# EAGLE design devil (EAGLE 9.5.2)
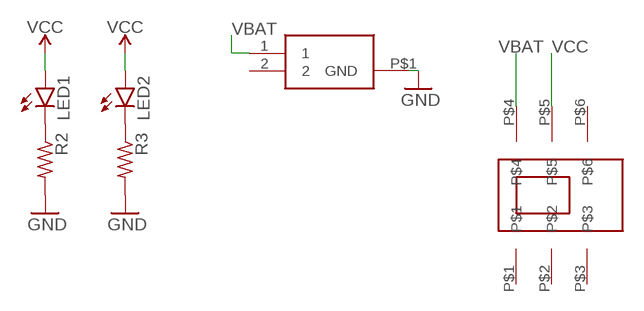
[diagram p0: schematic, sheet 1]

## Parts
LED1  LEDCHIP-LED0603  [CHIP-LED0603]
LED2  LEDCHIP-LED0603  [CHIP-LED0603]
R2  R-US_R0603  [R0603]
R3  R-US_R0603  [R0603]
U$1  CL-SB-22A-02T-SLIDE-SWITCH-TUCKED-PADS  [CL-SB-22A-02T-DPDT-COMPACT-SWITCH]
VBAT  BAT-HLD-012-SMT  [BATHLD012SMT]

## Nets
GND: R2.2 R3.2 VBAT.P$1(GND)
N$1: LED1.C R2.1
N$3: LED2.C R3.1
VBAT: U$1.P$4 VBAT.1
VCC: LED1.A LED2.A U$1.P$5
Unconnected: U$1.P$1 U$1.P$2 U$1.P$3 U$1.P$6 VBAT.2

## Library data of the parts
LED1 LED2 = led:LED: LED OSRAM: - CHIPLED LG R971, LG N971, LY N971, LG Q971, LY Q971, LO R971, LY R971 LH N974, LH R974 LS Q976, LO Q976, LY Q976 LO Q996 - Hyper CHIPLED LW Q18S LB Q993, LB Q99A, LB R99A - SideLED LS A670, LO A670, LY A670, LG A670, LP A670 LB A673, LV A673, LT A673, LW A673 LH A674 LY A675 LS A676, LA A676, LO A676, LY A676, LW A676 LS A679, LY A679, LG A679 - Hyper Micro SIDELED® LS Y876, LA Y876, LO Y876, LY Y876 LT Y87S - SmartLED LW L88C, LW L88S LB L89C, LB L89S, LG L890 LS L89K, LO L89K, LY L89K LS L896, LA L896, LO L896, LY L896 - TOPLED LS T670, LO T670, LY T670, LG T670, LP T670 LSG T670, LSP T670, LSY T670, LOP T670, LYG T670 LG T671, LOG T671, LSG T671 LB T673, LV T673, LT T673, LW T673 LH T674 LS T676, LA T676, LO T676, LY T676, LB T676, LH T676, LSB T676, LW T676 LB T67C, LV T67C, LT T67C, LS T67K, LO T67K, LY T67K, LW E67C LS E67B, LA E67B, LO E67B, LY E67B, LB E67C, LV E67C, LT E67C LW T67C LS T679, LY T679, LG T679 LS T770, LO T770, LY T770, LG T770, LP T770 LB T773, LV T773, LT T773, LW T773 LH T774 LS E675, LA E675, LY E675, LS T675 LS T776, LA T776, LO T776, LY T776, LB T776 LHGB T686 LT T68C, LB T68C - Hyper Mini TOPLED® LB M676 - Mini TOPLED Santana® LG M470 LS M47K, LO M47K, LY M47K Source: http://www.osram.convergy.de LUXEON: - LUMILED® LXK2-PW12-R00, LXK2-PW12-S00, LXK2-PW14-U00, LXK2-PW14-V00 LXK2-PM12-R00, LXK2-PM12-S00, LXK2-PM14-U00 LXK2-PE12-Q00, LXK2-PE12-R00, LXK2-PE12-S00, LXK2-PE14-T00, LXK2-PE14-U00 LXK2-PB12-K00, LXK2-PB12-L00, LXK2-PB12-M00, LXK2-PB14-N00, LXK2-PB14-P00, LXK2-PB14-Q00 LXK2-PR12-L00, LXK2-PR12-M00, LXK2-PR14-Q00, LXK2-PR14-R00 LXK2-PD12-Q00, LXK2-PD12-R00, LXK2-PD12-S00 LXK2-PH12-R00, LXK2-PH12-S00 LXK2-PL12-P00, LXK2-PL12-Q00, LXK2-PL12-R00 Source: www.luxeon.com KINGBRIGHT: KA-3528ASYC Source: www.kingbright.com
R2 R3 = rcl:R-US_: RESISTOR, American symbol; SPICEPREFIX: R
U$1 = electroninks:CL-SB-22A-02T-SLIDE-SWITCH-TUCKED-PADS
VBAT = SamacSys_Parts:BAT-HLD-012-SMT: Coin Cell Battery Holders Bat Hld CR1216/1225 Surface Mount Source: Datasheet <https://componentsearchengine.com/Datasheets/1/BAT-HLD-012-SMT.pdf>; DESCRIPTION: Coin Cell Battery Holders Bat Hld CR1216/1225 Surface Mount; HEIGHT: 3mm; MANUFACTURER_NAME: Linx Technologies; MANUFACTURER_PART_NUMBER: BAT-HLD-012-SMT; MOUSER_PART_NUMBER: 712-BAT-HLD-012-SMT; MOUSER_PRICE-STOCK: https://www.mouser.com/Search/Refine.aspx?Keyword=712-BAT-HLD-012-SMT

## Board
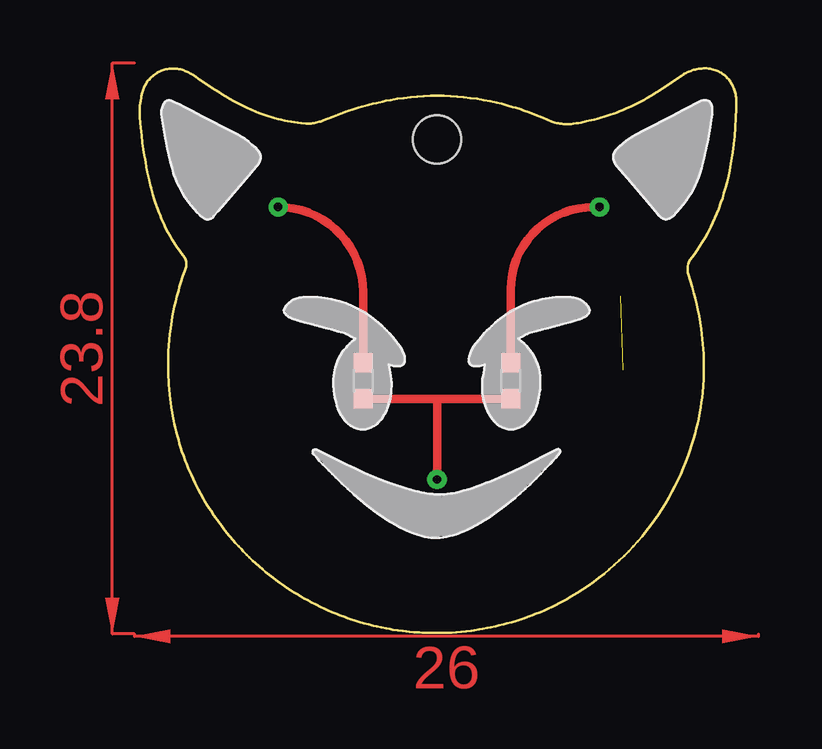
[diagram p1: board, top side]
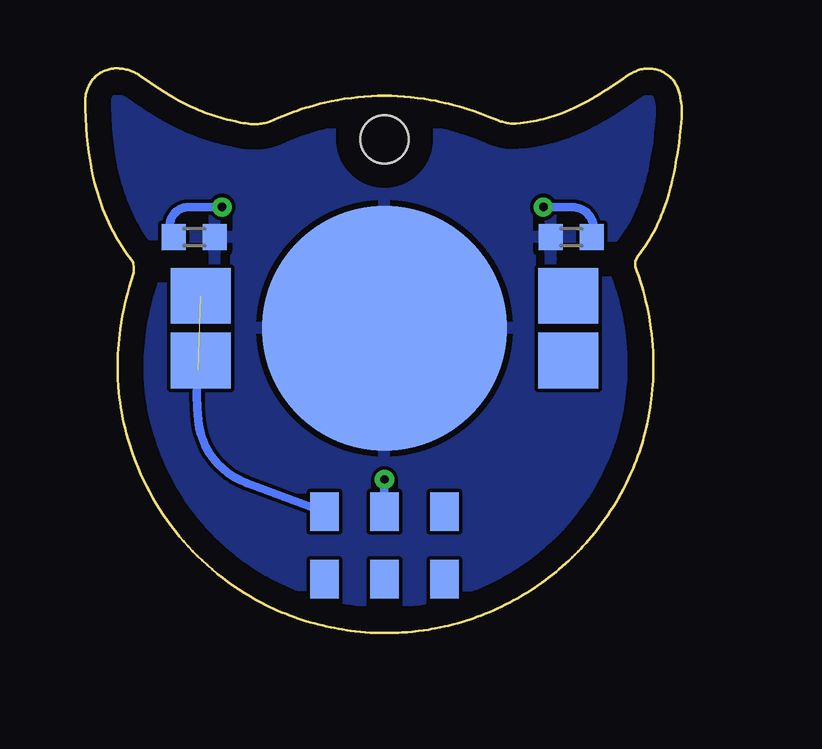
[diagram p2: board, bottom side, seen from below]

Size 24.86 x 23.54 mm. Coordinates in mm from the lower left corner, seen from the top.
Outline: 1.18,11.2 1.18,11.48 1.19,11.76 1.21,11.97 1.23,12.24 1.25,12.45 1.29,12.73 1.33,13 1.36,13.21 1.4,13.41 1.44,13.62 1.49,13.82 1.54,14.02 1.62,14.29 1.65,14.42 1.72,14.62 1.8,14.89 1.87,15.08 1.9,15.15 1.92,15.21 1.93,15.28 1.94,15.35 1.94,15.42 1.93,15.49 1.91,15.56 1.89,15.62 1.85,15.68 1.81,15.74 1.73,15.85 1.64,15.96 1.56,16.07 1.49,16.19 1.41,16.3 1.34,16.42 1.27,16.54 1.17,16.73 1.07,16.91 1.01,17.04 0.95,17.16 0.9,17.29 0.85,17.42 0.79,17.55 0.75,17.68 0.65,17.94 0.61,18.07 0.55,18.27 0.48,18.54 0.44,18.68 0.39,18.88 0.32,19.22 0.28,19.42 0.24,19.63 0.17,20.04 0.11,20.45 0.08,20.73 0.04,21.07 0.02,21.28 0.01,21.49 0,21.7 0,21.84 0,21.91 0.01,21.98 0.02,22.11 0.03,22.18 0.06,22.32 0.07,22.39 0.1,22.52 0.12,22.59 0.14,22.66 0.17,22.72 0.2,22.78 0.23,22.85 0.26,22.91 0.3,22.97 0.34,23.02 0.39,23.08 0.43,23.13 0.48,23.18 0.53,23.22 0.59,23.27 0.64,23.31 0.7,23.35 0.76,23.38 0.82,23.41 0.89,23.44 0.95,23.47 1.02,23.49 1.08,23.51 1.15,23.52 1.22,23.53 1.29,23.54 1.36,23.54 1.43,23.54 1.5,23.53 1.57,23.53 1.64,23.51 1.7,23.5 1.77,23.48 1.84,23.46 1.9,23.44 1.97,23.41 2.03,23.38 2.09,23.35 2.21,23.27 2.33,23.2 2.44,23.12 2.96,22.77 3.13,22.65 3.31,22.54 3.43,22.47 3.6,22.36 3.72,22.29 3.96,22.15 4.21,22.02 4.33,21.96 4.46,21.9 4.65,21.81 4.84,21.73 4.97,21.68 5.1,21.63 5.23,21.59 5.36,21.54 5.5,21.5 5.63,21.46 5.76,21.43 5.9,21.4 6.03,21.37 6.17,21.34 6.31,21.32 6.44,21.29 6.58,21.28 6.72,21.26 6.93,21.24 7,21.24 7.07,21.24 7.14,21.25 7.21,21.25 7.27,21.27 7.34,21.28 7.48,21.31 7.54,21.33 7.68,21.38 8.06,21.53 8.39,21.66 8.65,21.75 8.91,21.84 9.11,21.9 9.24,21.94 9.51,22.01 9.71,22.07 9.85,22.1 10.12,22.16 10.25,22.19 10.46,22.23 10.73,22.27 11.01,22.31 11.28,22.34 11.56,22.37 11.84,22.39 12.12,22.4 12.39,22.4 12.67,22.4 12.95,22.39 13.23,22.37 13.5,22.34 13.78,22.31 14.05,22.27 14.33,22.23 14.6,22.17 14.87,22.11 15.07,22.06 15.21,22.03 15.34,21.99 15.54,21.94 15.68,21.9 15.87,21.83 16.01,21.79 16.2,21.72 16.46,21.62 16.79,21.5 17.17,21.33 17.24,21.31 17.3,21.29 17.37,21.27 17.44,21.25 17.5,21.24 17.57,21.23 17.64,21.23 17.71,21.22 17.78,21.22 17.85,21.22 17.99,21.23 18.06,21.24 18.2,21.25 18.26,21.26 18.4,21.29 18.6,21.33 18.81,21.38 18.94,21.42 19.08,21.45 19.21,21.48 19.35,21.52 19.48,21.56 19.61,21.61 19.74,21.65 19.87,21.7 20,21.75 20.13,21.8 20.26,21.86 20.51,21.97 20.76,22.1 21,22.23 21.13,22.29 21.31,22.4 21.54,22.54 21.78,22.7 22.01,22.85 22.29,23.05 22.58,23.25 22.64,23.28 22.7,23.32 22.76,23.35 22.82,23.38 22.88,23.41 22.95,23.43 23.01,23.46 23.08,23.48 23.15,23.5 23.22,23.51 23.28,23.52 23.35,23.53 23.42,23.54 23.49,23.54 23.56,23.54 23.63,23.54 23.7,23.53 23.77,23.52 23.84,23.51 23.9,23.49 23.97,23.47 24.03,23.45 24.1,23.42 24.16,23.39 24.22,23.36 24.28,23.32 24.34,23.28 24.39,23.24 24.44,23.19 24.49,23.14 24.53,23.09 24.58,23.03 24.62,22.97 24.65,22.92 24.69,22.85 24.72,22.79 24.75,22.73 24.77,22.66 24.79,22.6 24.81,22.53 24.82,22.46 24.84,22.39 24.85,22.32 24.85,22.26 24.86,22.19 24.86,22.12 24.86,22.05 24.85,21.84 24.84,21.49 24.81,21.07 24.78,20.73 24.75,20.38 24.7,20.04 24.65,19.69 24.6,19.42 24.58,19.28 24.53,19.08 24.47,18.81 24.4,18.54 24.34,18.34 24.28,18.14 24.22,17.94 24.12,17.68 24.04,17.49 23.96,17.29 23.88,17.1 23.79,16.92 23.72,16.79 23.66,16.67 23.55,16.49 23.45,16.31 23.34,16.13 23.22,15.96 23.1,15.79 23.02,15.68 22.93,15.57 22.89,15.51 22.87,15.45 22.85,15.38 22.83,15.31 22.83,15.24 22.83,15.17 22.83,15.1 22.84,15.03 22.86,14.97 22.94,14.7 23.02,14.44 23.09,14.17 23.15,13.96 23.21,13.69 23.25,13.49 23.31,13.22 23.36,12.94 23.4,12.67 23.42,12.46 23.45,12.25 23.47,12.05 23.48,11.84 23.49,11.63 23.5,11.42 23.51,11.21 23.51,11 23.5,10.8 23.5,10.59 23.48,10.31 23.46,10.03 23.43,9.83 23.41,9.62 23.38,9.41 23.34,9.21 23.29,8.93 23.24,8.73 23.2,8.53 23.15,8.32 23.07,8.06 23.01,7.86 22.92,7.59 22.86,7.4 22.76,7.14 22.65,6.88 22.54,6.62 22.43,6.37 22.3,6.12 22.17,5.87 22.04,5.63 21.9,5.39 21.75,5.16 21.6,4.92 21.44,4.7 21.27,4.47 21.1,4.25 20.93,4.03 20.75,3.82 20.56,3.61 20.37,3.41 20.18,3.21 19.98,3.02 19.77,2.83 19.57,2.65 19.35,2.47 19.13,2.3 18.91,2.13 18.69,1.97 18.45,1.82 18.22,1.67 17.98,1.52 17.74,1.39 17.5,1.25 17.31,1.16 17.19,1.1 17,1.01 16.87,0.95 16.68,0.87 16.49,0.79 16.36,0.74 16.16,0.67 16.03,0.62 15.9,0.58 15.7,0.52 15.5,0.46 15.3,0.4 15.17,0.36 14.96,0.31 14.83,0.28 14.62,0.24 14.49,0.21 14.28,0.17 14.15,0.15 13.94,0.12 13.8,0.1 13.6,0.07 13.39,0.05 13.18,0.03 12.97,0.02 12.84,0.01 12.63,0 12.49,0 12.35,0 12.14,0 11.93,0.01 11.79,0.01 11.66,0.02 11.45,0.04 11.24,0.05 11.1,0.07 10.96,0.09 10.76,0.11 10.55,0.14 10.41,0.17 10.28,0.19 10.07,0.23 9.87,0.28 9.73,0.31 9.53,0.36 9.33,0.42 9.13,0.47 9,0.51 8.8,0.58 8.67,0.62 8.54,0.67 8.34,0.74 8.21,0.79 8.02,0.87 7.83,0.96 7.7,1.01 7.51,1.1 7.33,1.19 7.14,1.29 7.02,1.36 6.84,1.46 6.72,1.53 6.54,1.63 6.42,1.71 6.3,1.78 6.13,1.89 6.01,1.97 5.84,2.09 5.67,2.21 5.56,2.3 5.4,2.43 5.24,2.56 5.13,2.65 4.97,2.78 4.82,2.92 4.71,3.01 4.56,3.16 4.46,3.26 4.32,3.4 4.22,3.5 4.12,3.61 3.98,3.76 3.89,3.86 3.76,4.02 3.63,4.18 3.5,4.35 3.41,4.46 3.29,4.63 3.17,4.8 3.09,4.91 2.97,5.08 2.9,5.2 2.82,5.32 2.71,5.5 2.64,5.62 2.54,5.8 2.44,5.98 2.38,6.11 2.32,6.23 2.23,6.42 2.14,6.61 2.08,6.73 2.03,6.86 1.95,7.06 1.9,7.19 1.83,7.38 1.76,7.58 1.72,7.71 1.65,7.91 1.62,8.04 1.58,8.18 1.52,8.38 1.47,8.58 1.44,8.72 1.41,8.85 1.37,9.06 1.35,9.19 1.32,9.4 1.29,9.61 1.27,9.74 1.24,9.95 1.22,10.16 1.21,10.37 1.2,10.51 1.19,10.71 1.18,10.85 1.18,11.06 1.18,11.2
Copper layers (1*16): Top 0.035mm / dielectric 0.6mm / Bottom 0.035mm
Design rules "default *": minimum track width 6mil, minimum drill 0.35mm, track to track 6mil, track to pad 6mil, pad to pad 6mil, via to via 6mil, smd to smd 6mil, copper to edge 40mil, drill to drill 6mil, minimum pad ring 10mil, minimum via ring 0mil, stop-mask expansion 4mil, vias tented up to drill 0.35mm, thermal gap 10mil
Holes 2 mm at 12.39,20.58

### Footprints (pad centres in the part's own frame; a part is rotated, then mirrored left to right if it is on the bottom)
CHIP-LED0603 = smd 0.8 x 0.8: A 0,-0.75; C 0,0.75
R0603 = smd 1 x 1.1: 1 -0.85,0; 2 0.85,0
CL-SB-22A-02T-DPDT-COMPACT-SWITCH = smd 1.2 x 1.6: P$1 -2.5,-1.4; P$2 0,-1.4; P$3 2.5,-1.4; P$4 -2.5,1.4; P$5 0,1.4; P$6 2.5,1.4
BATHLD012SMT = smd 2.5 x 2.325: 1 -7.65,1.35; 2 7.65,1.35; P$2 -7.65,-1.35; P$3 7.65,-1.35 | smd 10.2 x 10.2: P$1 0,0

### Placement (x,y rotation side)
LED1  9.31,10.52 0 top
LED2  15.46,10.52 0 top
R2  4.61,16.51 180 bottom
R3  20.32,16.51 0 bottom
U$1  12.39,3.65 0 bottom
VBAT  12.39,12.71 0 bottom

### Tracks (layer width: path | path; a pad name or v marks a point on that pad's centre or on a via)
GND
  pour Bottom: -0.22,23.77 25.78,23.77 25.78,-0.04 -0.22,-0.04
N$1  (via drill 0.35 pad 0.8)
  Top 0.35: LED1.C 9.31,14.22 arc90 v5.77,17.76
  Bottom 0.35: v5.77,17.76 4.56,17.76 arc115 R2.1
N$3  (via drill 0.35 pad 0.8)
  Top 0.35: LED2.C 15.46,14.32 arc-90 18.9,17.76 v19.16,17.76
  Bottom 0.35: v19.16,17.76 20.56,17.76 arc-128 R3.1
VBAT  (1 unrouted)
  Bottom 0.35: U$1.P$4 18.16,6.26 arc63 20.16,8.86 arc12 20.16,10.96
VCC  (via drill 0.35 pad 0.8)
  Top 0.35: LED1.A 12.39,9.77 | LED2.A 12.56,9.77 12.39,9.77 | v12.39,6.4 12.39,9.77
  Bottom 0.35: U$1.P$5 v12.39,6.4
(copper drawn outside any net)
  shapes: Top area x2